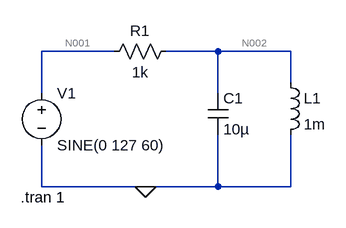
[diagram p0: schematic Draft2.asc]
Draft2.asc, the LTspice schematic file:
Version 4.1
SHEET 1 880 680
WIRE 96 16 -16 16
WIRE 256 16 176 16
WIRE 368 16 256 16
WIRE 368 64 368 16
WIRE -16 80 -16 16
WIRE 256 80 256 16
WIRE -16 224 -16 160
WIRE 144 224 -16 224
WIRE 256 224 256 144
WIRE 256 224 144 224
WIRE 368 224 368 144
WIRE 368 224 256 224
FLAG 144 224 0
SYMBOL voltage -16 64 R0
WINDOW 123 0 0 Left 0
WINDOW 39 0 0 Left 0
SYMATTR InstName V1
SYMATTR Value SINE(0 127 60)
SYMBOL res 192 0 R90
WINDOW 0 0 56 VBottom 2
WINDOW 3 32 56 VTop 2
SYMATTR InstName R1
SYMATTR Value 1k
SYMBOL cap 240 80 R0
SYMATTR InstName C1
SYMATTR Value 10µ
SYMBOL ind 352 48 R0
SYMATTR InstName L1
SYMATTR Value 1m
SYMATTR SpiceLine Rser=1m
TEXT -48 240 Left 2 !.tran 1

The netlist it stands for:
* Draft2.asc
V1 N001 0 SINE(0 127 60)
R1 N002 N001 1k
C1 N002 0 10µ
L1 N002 0 1m Rser=1m
.tran 1
.backanno
.end

* Results of the author's LTspice run, read from the files saved beside the schematic
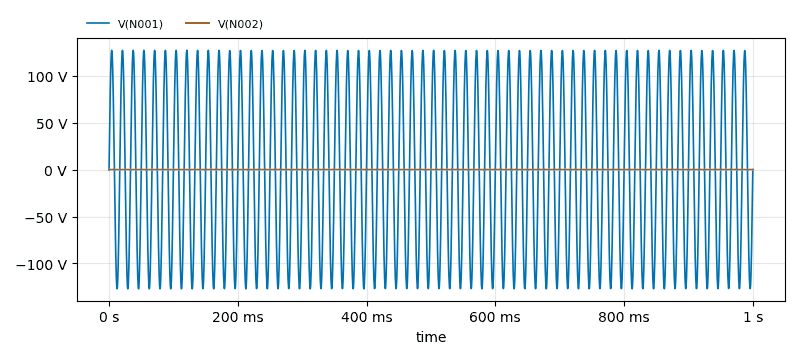
[diagram p1: Transient Analysis of Draft2.asc, plotted from the saved traces]
* Transient Analysis, 1 run:
*   V(N001): min -127 V, max 127 V, average 1.716 mV, rms 90.01 V, last 0 V
*   V(N002): min -80.13 mV, max 93.24 mV, average -34.21 nV, rms 34.31 mV, last 48.2 mV